# Altium schematic sheet RS232.SchDoc
size 297 x 209 mm; SheetNumber: 10; SheetTotal: 29
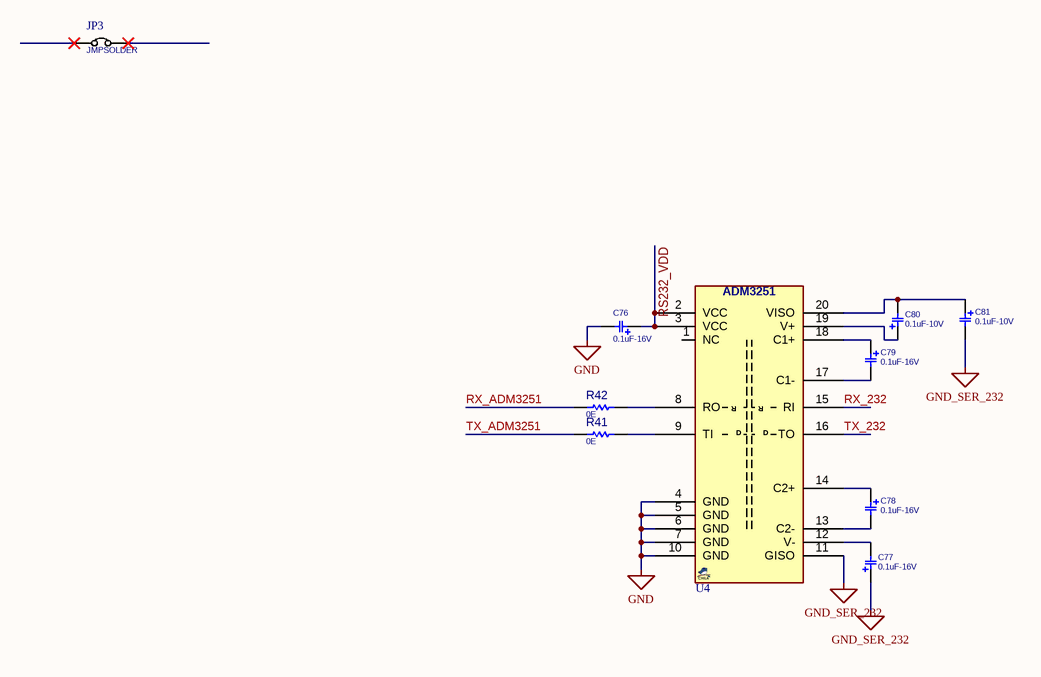
[diagram p0: RS232.SchDoc]

## Parts
C76  0.1uF-16V  [C_TN_3216]
C77  0.1uF-16V  [C_TN_3216]
C78  0.1uF-16V  [C_TN_3216]
C79  0.1uF-16V  [C_TN_3216]
C80  0.1uF-10V  [C_TN_3216]
C81  0.1uF-10V  [C_TN_3216]
JP3  JMPSOLDER  [JP_40X50]
R41  0E  [R0805]
R42  0E  [R0805]
U4  ADM3251  [SO_20_W]  (value not drawn)

## Nets
GND: C76.2 U4.4(GND) U4.5(GND) U4.6(GND) U4.7(GND) U4.10(GND)
GND_SER_232: C77.1 C81.2 U4.11(GISO)
RS232_VDD: C76.1 U4.2(VCC) U4.3(VCC)
RX_232: U4.15(RI)
RX_ADM3251: R42.1
TX_232: U4.16(TO)
TX_ADM3251: R41.1
NetC77_2: C77.2 U4.12(V-)
NetC78_1: C78.1 U4.14(C2+)
NetC78_2: C78.2 U4.13(C2-)
NetC79_1: C79.1 U4.18(C1+)
NetC79_2: C79.2 U4.17(C1-)
NetC80_1: C80.1 U4.19(V+)
NetC80_2: C80.2 C81.1 U4.20(VISO)
NetR41_2: R41.2 U4.9(TI)
NetR42_2: R42.2 U4.8(RO)

Not connected (* = marked no-connect by the designer): JP3 1* 2*; U4 1(NC)

## Notes on the sheet
- Drawn
- Name
- Date
- Drawing Title
- Checked
- Drawing No.
- Approved
- Size
- A4
- Ver.
- Rev.
- Sheet
- Of
- (in symbol ADM3251_SO16W) R; D

## Library data of the parts
C76-C81 = CAP_SMD_TAN_10uF_6.3V: CAP, SMD, TAN; PARAM: 20%, 300mOhm, -55~105oC; MANF: VISHAY; MANF_P#: T55A106M6R3C0300; PARAM2: 6.3V; PRICE: 0.46$
  C76-C79: VALUE: 0.1uF-16V
  C80 C81: VALUE: 0.1uF-10V
JP3 = JUMPER_SOLDER: JUMPER, HEADER 2PIN; MANF: MANF; MANF_P#: MANF_P#; VALUE: JMPSOLDER
R41 R42 = RES_SMD_0805: RESISTOR, SMD; PARAM: -W; DESC: DESCRIPTION; DIST#: MOUSER; PARAM2: 1%; MANF_P#: -; MANF: -; ASSEMBLY: ASSEMBLY; PRICE: 100= 0.5$; VALUE: 0E
U4 = ADM3251_SO16W: RS-485 Transceiver, Isolated, iIntegrated Transformer Driver, 460kbps; MANF: Analog Devices; MANF_P#: ADM3251EARWZ; PARAM2: 5/3.3 (VDD1); PARAM: 2.5KV Isolating, 460kbps, -40~85°C; PRICE: 7$; VALUE: ADM3251